# Altium schematic sheet 06 CPU_RAM.SchDoc
size 420 x 297 mm; Address1: Address1; Address2: Address2; Address3: Address3; Address4: Address4; DocumentNumber: АБВГ.123456.001 Э3; SheetNumber: 6; SheetTotal: 23; Scale: 1:1; DocumentType: Схема электрическая принципиальная; FirstReferrence: АБВГ.123456.001
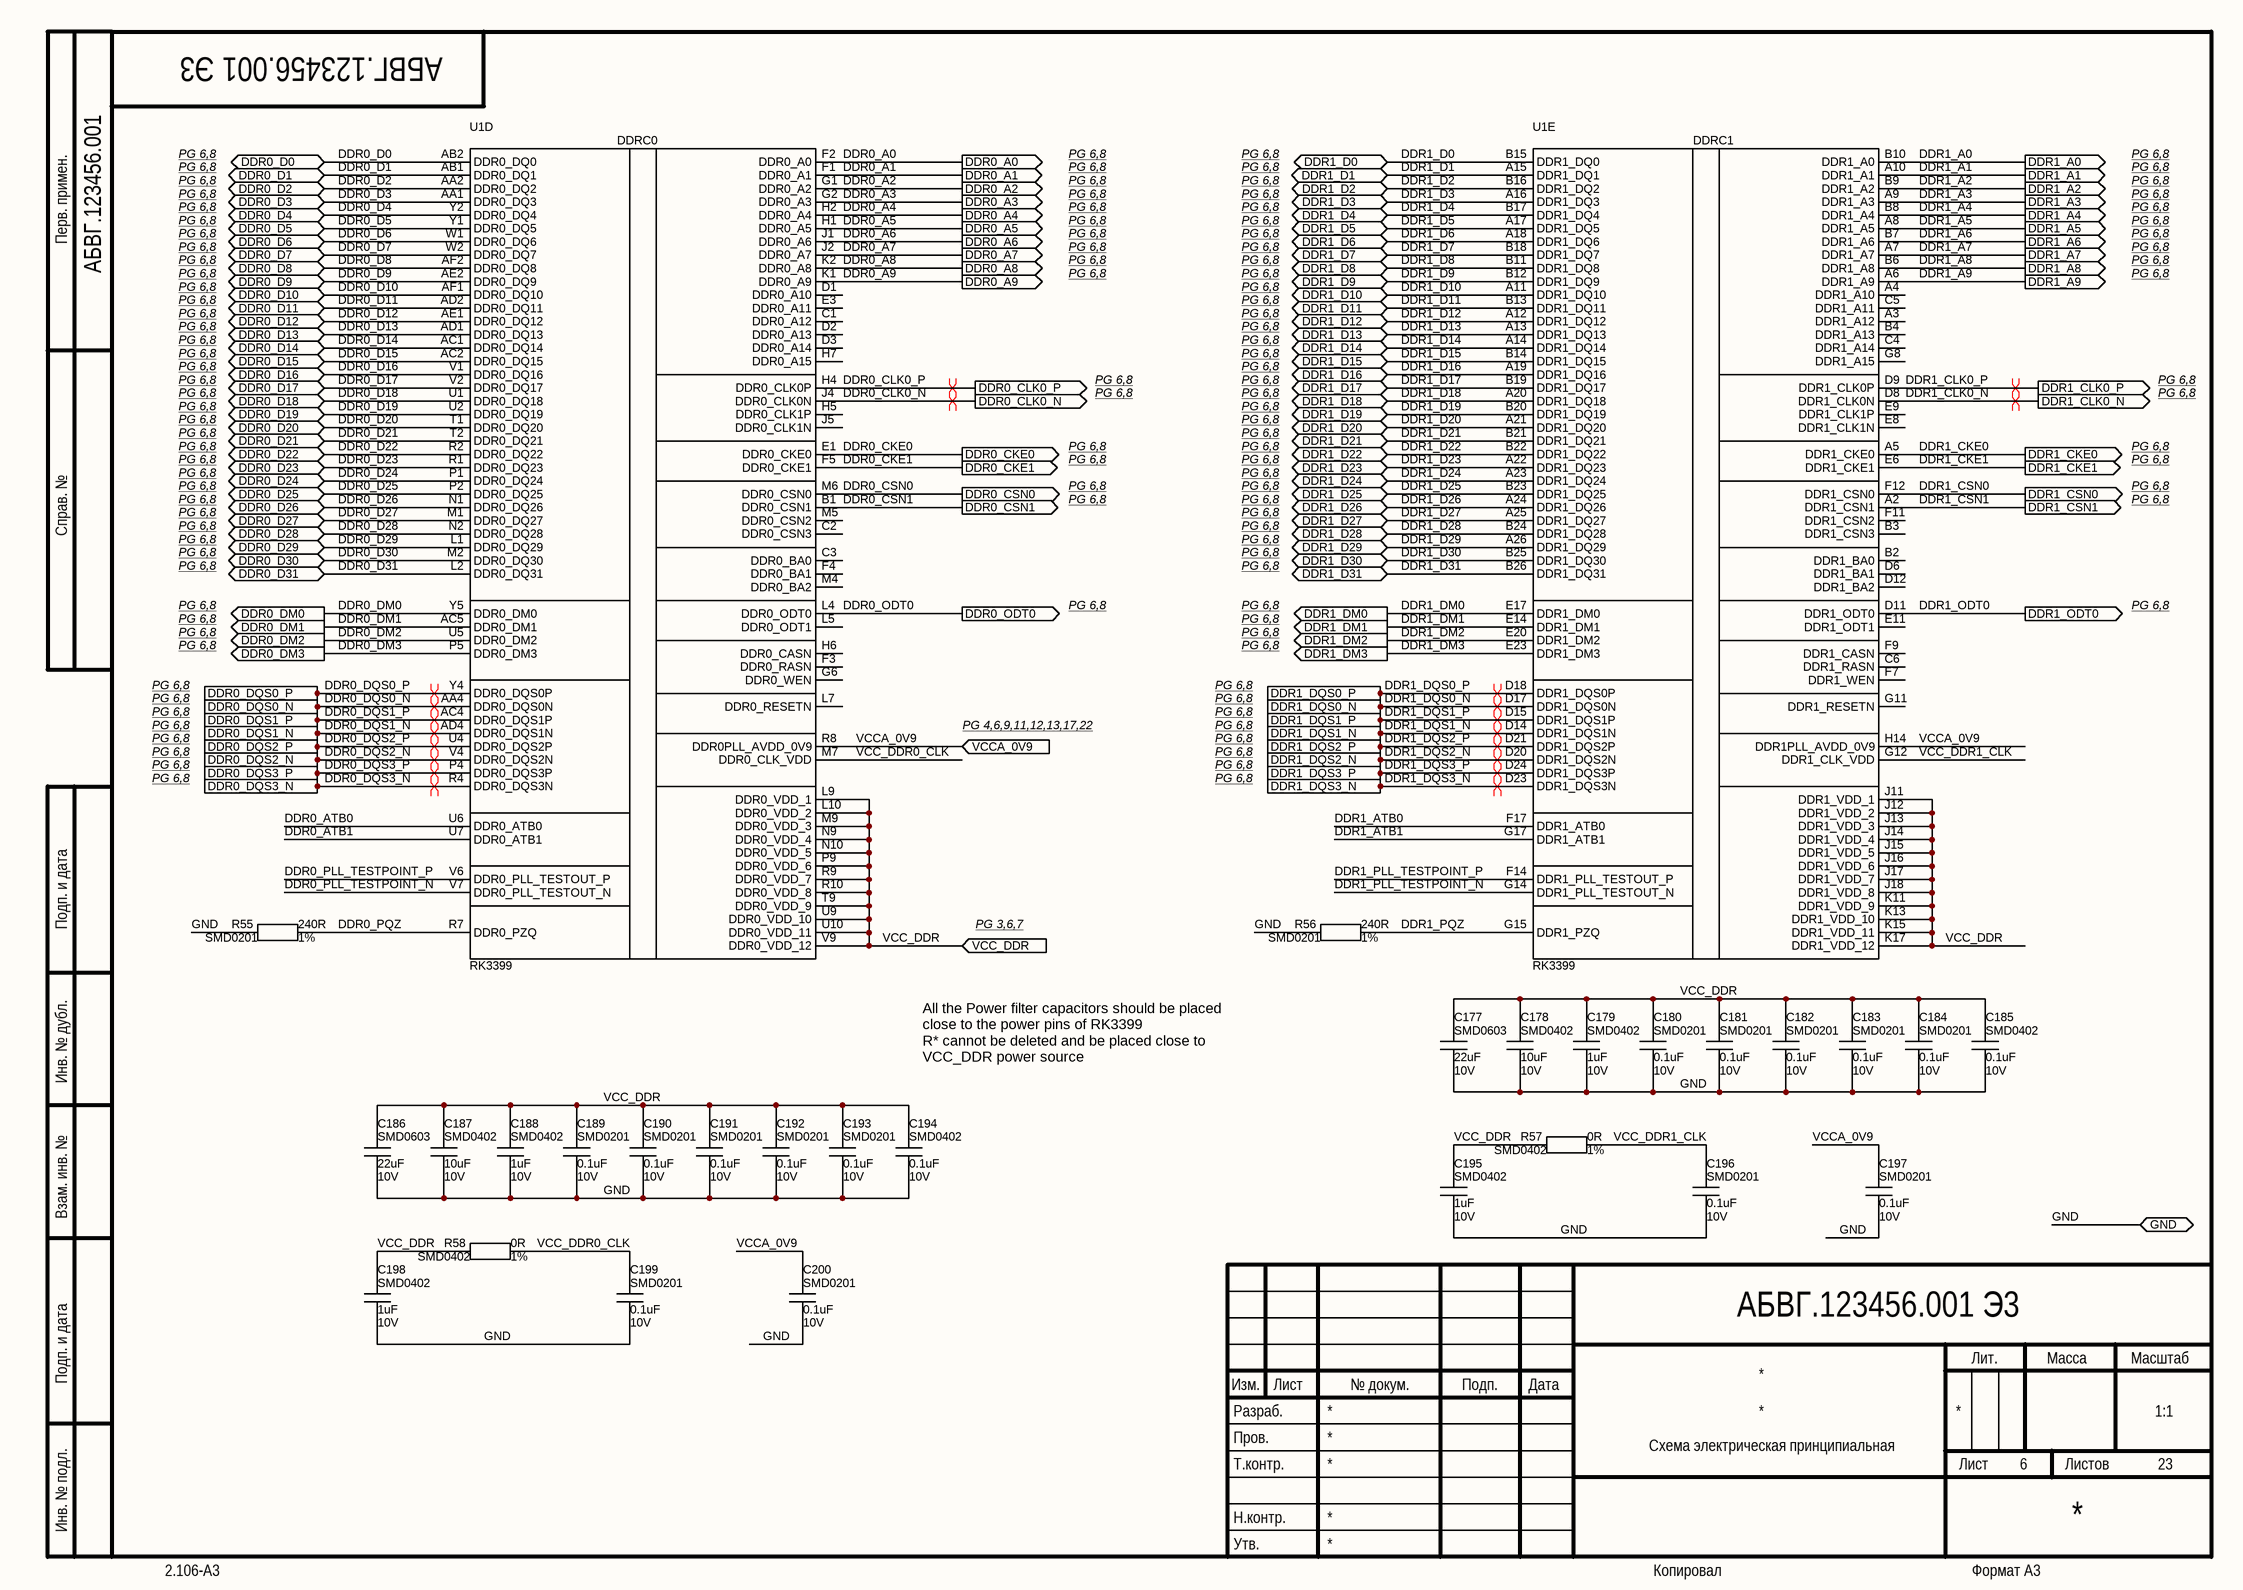
[diagram p0: 06 CPU_RAM.SchDoc]

## Parts
C177  Package: SMD0603  Voltage: 10V  [CAP_SMD_0603]  (hidden comment: 22uF)
C178  Package: SMD0402  Voltage: 10V  [CAP_SMD_0402_small]  (hidden comment: 10uF)
C179  Package: SMD0402  Voltage: 10V  [CAP_SMD_0402_small]  (hidden comment: 1uF)
C180  Package: SMD0201  Voltage: 10V  [CAP_SMD_0201]  (hidden comment: 0.1uF)
C181  Package: SMD0201  Voltage: 10V  [CAP_SMD_0201]  (hidden comment: 0.1uF)
C182  Package: SMD0201  Voltage: 10V  [CAP_SMD_0201]  (hidden comment: 0.1uF)
C183  Package: SMD0201  Voltage: 10V  [CAP_SMD_0201]  (hidden comment: 0.1uF)
C184  Package: SMD0201  Voltage: 10V  [CAP_SMD_0201]  (hidden comment: 0.1uF)
C185  Package: SMD0402  Voltage: 10V  [CAP_SMD_0402]  (hidden comment: 0.1uF)
C186  Package: SMD0603  Voltage: 10V  [CAP_SMD_0603]  (hidden comment: 22uF)
C187  Package: SMD0402  Voltage: 10V  [CAP_SMD_0402_small]  (hidden comment: 10uF)
C188  Package: SMD0402  Voltage: 10V  [CAP_SMD_0402_small]  (hidden comment: 1uF)
C189  Package: SMD0201  Voltage: 10V  [CAP_SMD_0201]  (hidden comment: 0.1uF)
C190  Package: SMD0201  Voltage: 10V  [CAP_SMD_0201]  (hidden comment: 0.1uF)
C191  Package: SMD0201  Voltage: 10V  [CAP_SMD_0201]  (hidden comment: 0.1uF)
C192  Package: SMD0201  Voltage: 10V  [CAP_SMD_0201]  (hidden comment: 0.1uF)
C193  Package: SMD0201  Voltage: 10V  [CAP_SMD_0201]  (hidden comment: 0.1uF)
C194  Package: SMD0402  Voltage: 10V  [CAP_SMD_0402]  (hidden comment: 0.1uF)
C195  Package: SMD0402  Voltage: 10V  [CAP_SMD_0402_small]  (hidden comment: 1uF)
C196  Package: SMD0201  Voltage: 10V  [CAP_SMD_0201]  (hidden comment: 0.1uF)
C197  Package: SMD0201  Voltage: 10V  [CAP_SMD_0201]  (hidden comment: 0.1uF)
C198  Package: SMD0402  Voltage: 10V  [CAP_SMD_0402_small]  (hidden comment: 1uF)
C199  Package: SMD0201  Voltage: 10V  [CAP_SMD_0201]  (hidden comment: 0.1uF)
C200  Package: SMD0201  Voltage: 10V  [CAP_SMD_0201]  (hidden comment: 0.1uF)
R55  Package: SMD0201  Tolerance: 1%  [RES_SMD_0201]  (hidden comment: 240R)
R56  Package: SMD0201  Tolerance: 1%  [RES_SMD_0201]  (hidden comment: 240R)
R57  Package: SMD0402  Tolerance: 1%  [RES_SMD_0402_SMALL]  (hidden comment: 0R)
R58  Package: SMD0402  Tolerance: 1%  [RES_SMD_0402_SMALL]  (hidden comment: 0R)
U1  value RK3399  [BGA828C65P31X31_2100X2100X161N]  (hidden comment: RK3399_FF)  (parts D,E of 23)

## Ports
DDR0_A0 (out), DDR0_A1 (out), DDR0_A2 (out), DDR0_A3 (out), DDR0_A4 (out), DDR0_A5 (out), DDR0_A6 (out), DDR0_A7 (out), DDR0_A8 (out), DDR0_A9 (out), DDR0_CKE0 (out), DDR0_CKE1 (out), DDR0_CLK0_N (out), DDR0_CLK0_P (out), DDR0_CSN0 (out), DDR0_CSN1 (out), DDR0_D0 (bidir), DDR0_D1 (bidir), DDR0_D2 (bidir), DDR0_D3 (bidir), DDR0_D4 (bidir), DDR0_D5 (bidir), DDR0_D6 (bidir), DDR0_D7 (bidir), DDR0_D8 (bidir), DDR0_D9 (bidir), DDR0_D10 (bidir), DDR0_D11 (bidir), DDR0_D12 (bidir), DDR0_D13 (bidir), DDR0_D14 (bidir), DDR0_D15 (bidir), DDR0_D16 (bidir), DDR0_D17 (bidir), DDR0_D18 (bidir), DDR0_D19 (bidir), DDR0_D20 (bidir), DDR0_D21 (bidir), DDR0_D22 (bidir), DDR0_D23 (bidir), DDR0_D24 (bidir), DDR0_D25 (bidir), DDR0_D26 (bidir), DDR0_D27 (bidir), DDR0_D28 (bidir), DDR0_D29 (bidir), DDR0_D30 (bidir), DDR0_D31 (bidir), DDR0_DM0 (out), DDR0_DM1 (out), DDR0_DM2 (out), DDR0_DM3 (out), DDR0_DQS0_N (out), DDR0_DQS0_P (out), DDR0_DQS1_N (out), DDR0_DQS1_P (out), DDR0_DQS2_N (out), DDR0_DQS2_P (out), DDR0_DQS3_N (out), DDR0_DQS3_P (out), DDR0_ODT0 (out), DDR1_A0 (out), DDR1_A1 (out), DDR1_A2 (out), DDR1_A3 (out), DDR1_A4 (out), DDR1_A5 (out), DDR1_A6 (out), DDR1_A7 (out), DDR1_A8 (out), DDR1_A9 (out), DDR1_CKE0 (out), DDR1_CKE1 (out), DDR1_CLK0_N (out), DDR1_CLK0_P (out), DDR1_CSN0 (out), DDR1_CSN1 (out), DDR1_D0 (bidir), DDR1_D1 (bidir), DDR1_D2 (bidir), DDR1_D3 (bidir), DDR1_D4 (bidir), DDR1_D5 (bidir), DDR1_D6 (bidir), DDR1_D7 (bidir), DDR1_D8 (bidir), DDR1_D9 (bidir), DDR1_D10 (bidir), DDR1_D11 (bidir), DDR1_D12 (bidir), DDR1_D13 (bidir), DDR1_D14 (bidir), DDR1_D15 (bidir), DDR1_D16 (bidir), DDR1_D17 (bidir), DDR1_D18 (bidir), DDR1_D19 (bidir), DDR1_D20 (bidir), DDR1_D21 (bidir), DDR1_D22 (bidir), DDR1_D23 (bidir), DDR1_D24 (bidir), DDR1_D25 (bidir), DDR1_D26 (bidir), DDR1_D27 (bidir), DDR1_D28 (bidir), DDR1_D29 (bidir), DDR1_D30 (bidir), DDR1_D31 (bidir), DDR1_DM0 (out), DDR1_DM1 (out), DDR1_DM2 (out), DDR1_DM3 (out), DDR1_DQS0_N (out), DDR1_DQS0_P (out), DDR1_DQS1_N (out), DDR1_DQS1_P (out), DDR1_DQS2_N (out), DDR1_DQS2_P (out), DDR1_DQS3_N (out), DDR1_DQS3_P (out), DDR1_ODT0 (out), GND (bidir), VCC_DDR (in), VCCA_0V9 (in)

## Nets
DDR0_A0: U1.F2(DDR0_A0) ; port DDR0_A0
DDR0_A1: U1.F1(DDR0_A1) ; port DDR0_A1
DDR0_A2: U1.G1(DDR0_A2) ; port DDR0_A2
DDR0_A3: U1.G2(DDR0_A3) ; port DDR0_A3
DDR0_A4: U1.H2(DDR0_A4) ; port DDR0_A4
DDR0_A5: U1.H1(DDR0_A5) ; port DDR0_A5
DDR0_A6: U1.J1(DDR0_A6) ; port DDR0_A6
DDR0_A7: U1.J2(DDR0_A7) ; port DDR0_A7
DDR0_A8: U1.K2(DDR0_A8) ; port DDR0_A8
DDR0_A9: U1.K1(DDR0_A9) ; port DDR0_A9
DDR0_ATB0: U1.U6(DDR0_ATB0)
DDR0_ATB1: U1.U7(DDR0_ATB1)
DDR0_CKE0: U1.E1(DDR0_CKE0) ; port DDR0_CKE0
DDR0_CKE1: U1.F5(DDR0_CKE1) ; port DDR0_CKE1
DDR0_CLK0_N: U1.J4(DDR0_CLK0N) ; port DDR0_CLK0_N
DDR0_CLK0_P: U1.H4(DDR0_CLK0P) ; port DDR0_CLK0_P
DDR0_CSN0: U1.M6(DDR0_CSN0) ; port DDR0_CSN0
DDR0_CSN1: U1.B1(DDR0_CSN1) ; port DDR0_CSN1
DDR0_D0: U1.AB2(DDR0_DQ0) ; port DDR0_D0
DDR0_D1: U1.AB1(DDR0_DQ1) ; port DDR0_D1
DDR0_D2: U1.AA2(DDR0_DQ2) ; port DDR0_D2
DDR0_D3: U1.AA1(DDR0_DQ3) ; port DDR0_D3
DDR0_D4: U1.Y2(DDR0_DQ4) ; port DDR0_D4
DDR0_D5: U1.Y1(DDR0_DQ5) ; port DDR0_D5
DDR0_D6: U1.W1(DDR0_DQ6) ; port DDR0_D6
DDR0_D7: U1.W2(DDR0_DQ7) ; port DDR0_D7
DDR0_D8: U1.AF2(DDR0_DQ8) ; port DDR0_D8
DDR0_D9: U1.AE2(DDR0_DQ9) ; port DDR0_D9
DDR0_D10: U1.AF1(DDR0_DQ10) ; port DDR0_D10
DDR0_D11: U1.AD2(DDR0_DQ11) ; port DDR0_D11
DDR0_D12: U1.AE1(DDR0_DQ12) ; port DDR0_D12
DDR0_D13: U1.AD1(DDR0_DQ13) ; port DDR0_D13
DDR0_D14: U1.AC1(DDR0_DQ14) ; port DDR0_D14
DDR0_D15: U1.AC2(DDR0_DQ15) ; port DDR0_D15
DDR0_D16: U1.V1(DDR0_DQ16) ; port DDR0_D16
DDR0_D17: U1.V2(DDR0_DQ17) ; port DDR0_D17
DDR0_D18: U1.U1(DDR0_DQ18) ; port DDR0_D18
DDR0_D19: U1.U2(DDR0_DQ19) ; port DDR0_D19
DDR0_D20: U1.T1(DDR0_DQ20) ; port DDR0_D20
DDR0_D21: U1.T2(DDR0_DQ21) ; port DDR0_D21
DDR0_D22: U1.R2(DDR0_DQ22) ; port DDR0_D22
DDR0_D23: U1.R1(DDR0_DQ23) ; port DDR0_D23
DDR0_D24: U1.P1(DDR0_DQ24) ; port DDR0_D24
DDR0_D25: U1.P2(DDR0_DQ25) ; port DDR0_D25
DDR0_D26: U1.N1(DDR0_DQ26) ; port DDR0_D26
DDR0_D27: U1.M1(DDR0_DQ27) ; port DDR0_D27
DDR0_D28: U1.N2(DDR0_DQ28) ; port DDR0_D28
DDR0_D29: U1.L1(DDR0_DQ29) ; port DDR0_D29
DDR0_D30: U1.M2(DDR0_DQ30) ; port DDR0_D30
DDR0_D31: U1.L2(DDR0_DQ31) ; port DDR0_D31
DDR0_DM0: U1.Y5(DDR0_DM0) ; port DDR0_DM0
DDR0_DM1: U1.AC5(DDR0_DM1) ; port DDR0_DM1
DDR0_DM2: U1.U5(DDR0_DM2) ; port DDR0_DM2
DDR0_DM3: U1.P5(DDR0_DM3) ; port DDR0_DM3
DDR0_DQS0_N: U1.AA4(DDR0_DQS0N) ; port DDR0_DQS0_N
DDR0_DQS0_P: U1.Y4(DDR0_DQS0P) ; port DDR0_DQS0_P
DDR0_DQS1_N: U1.AD4(DDR0_DQS1N) ; port DDR0_DQS1_N
DDR0_DQS1_P: U1.AC4(DDR0_DQS1P) ; port DDR0_DQS1_P
DDR0_DQS2_N: U1.V4(DDR0_DQS2N) ; port DDR0_DQS2_N
DDR0_DQS2_P: U1.U4(DDR0_DQS2P) ; port DDR0_DQS2_P
DDR0_DQS3_N: U1.R4(DDR0_DQS3N) ; port DDR0_DQS3_N
DDR0_DQS3_P: U1.P4(DDR0_DQS3P) ; port DDR0_DQS3_P
DDR0_ODT0: U1.L4(DDR0_ODT0) ; port DDR0_ODT0
DDR0_PLL_TESTPOINT_N: U1.V7(DDR0_PLL_TESTOUT_N)
DDR0_PLL_TESTPOINT_P: U1.V6(DDR0_PLL_TESTOUT_P)
DDR0_PQZ: R55.1 U1.R7(DDR0_PZQ)
DDR1_A0: U1.B10(DDR1_A0) ; port DDR1_A0
DDR1_A1: U1.A10(DDR1_A1) ; port DDR1_A1
DDR1_A2: U1.B9(DDR1_A2) ; port DDR1_A2
DDR1_A3: U1.A9(DDR1_A3) ; port DDR1_A3
DDR1_A4: U1.B8(DDR1_A4) ; port DDR1_A4
DDR1_A5: U1.A8(DDR1_A5) ; port DDR1_A5
DDR1_A6: U1.B7(DDR1_A6) ; port DDR1_A6
DDR1_A7: U1.A7(DDR1_A7) ; port DDR1_A7
DDR1_A8: U1.B6(DDR1_A8) ; port DDR1_A8
DDR1_A9: U1.A6(DDR1_A9) ; port DDR1_A9
DDR1_ATB0: U1.F17(DDR1_ATB0)
DDR1_ATB1: U1.G17(DDR1_ATB1)
DDR1_CKE0: U1.A5(DDR1_CKE0) ; port DDR1_CKE0
DDR1_CKE1: U1.E6(DDR1_CKE1) ; port DDR1_CKE1
DDR1_CLK0_N: U1.D8(DDR1_CLK0N) ; port DDR1_CLK0_N
DDR1_CLK0_P: U1.D9(DDR1_CLK0P) ; port DDR1_CLK0_P
DDR1_CSN0: U1.F12(DDR1_CSN0) ; port DDR1_CSN0
DDR1_CSN1: U1.A2(DDR1_CSN1) ; port DDR1_CSN1
DDR1_D0: U1.B15(DDR1_DQ0) ; port DDR1_D0
DDR1_D1: U1.A15(DDR1_DQ1) ; port DDR1_D1
DDR1_D2: U1.B16(DDR1_DQ2) ; port DDR1_D2
DDR1_D3: U1.A16(DDR1_DQ3) ; port DDR1_D3
DDR1_D4: U1.B17(DDR1_DQ4) ; port DDR1_D4
DDR1_D5: U1.A17(DDR1_DQ5) ; port DDR1_D5
DDR1_D6: U1.A18(DDR1_DQ6) ; port DDR1_D6
DDR1_D7: U1.B18(DDR1_DQ7) ; port DDR1_D7
DDR1_D8: U1.B11(DDR1_DQ8) ; port DDR1_D8
DDR1_D9: U1.B12(DDR1_DQ9) ; port DDR1_D9
DDR1_D10: U1.A11(DDR1_DQ10) ; port DDR1_D10
DDR1_D11: U1.B13(DDR1_DQ11) ; port DDR1_D11
DDR1_D12: U1.A12(DDR1_DQ12) ; port DDR1_D12
DDR1_D13: U1.A13(DDR1_DQ13) ; port DDR1_D13
DDR1_D14: U1.A14(DDR1_DQ14) ; port DDR1_D14
DDR1_D15: U1.B14(DDR1_DQ15) ; port DDR1_D15
DDR1_D16: U1.A19(DDR1_DQ16) ; port DDR1_D16
DDR1_D17: U1.B19(DDR1_DQ17) ; port DDR1_D17
DDR1_D18: U1.A20(DDR1_DQ18) ; port DDR1_D18
DDR1_D19: U1.B20(DDR1_DQ19) ; port DDR1_D19
DDR1_D20: U1.A21(DDR1_DQ20) ; port DDR1_D20
DDR1_D21: U1.B21(DDR1_DQ21) ; port DDR1_D21
DDR1_D22: U1.B22(DDR1_DQ22) ; port DDR1_D22
DDR1_D23: U1.A22(DDR1_DQ23) ; port DDR1_D23
DDR1_D24: U1.A23(DDR1_DQ24) ; port DDR1_D24
DDR1_D25: U1.B23(DDR1_DQ25) ; port DDR1_D25
DDR1_D26: U1.A24(DDR1_DQ26) ; port DDR1_D26
DDR1_D27: U1.A25(DDR1_DQ27) ; port DDR1_D27
DDR1_D28: U1.B24(DDR1_DQ28) ; port DDR1_D28
DDR1_D29: U1.A26(DDR1_DQ29) ; port DDR1_D29
DDR1_D30: U1.B25(DDR1_DQ30) ; port DDR1_D30
DDR1_D31: U1.B26(DDR1_DQ31) ; port DDR1_D31
DDR1_DM0: U1.E17(DDR1_DM0) ; port DDR1_DM0
DDR1_DM1: U1.E14(DDR1_DM1) ; port DDR1_DM1
DDR1_DM2: U1.E20(DDR1_DM2) ; port DDR1_DM2
DDR1_DM3: U1.E23(DDR1_DM3) ; port DDR1_DM3
DDR1_DQS0_N: U1.D17(DDR1_DQS0N) ; port DDR1_DQS0_N
DDR1_DQS0_P: U1.D18(DDR1_DQS0P) ; port DDR1_DQS0_P
DDR1_DQS1_N: U1.D14(DDR1_DQS1N) ; port DDR1_DQS1_N
DDR1_DQS1_P: U1.D15(DDR1_DQS1P) ; port DDR1_DQS1_P
DDR1_DQS2_N: U1.D20(DDR1_DQS2N) ; port DDR1_DQS2_N
DDR1_DQS2_P: U1.D21(DDR1_DQS2P) ; port DDR1_DQS2_P
DDR1_DQS3_N: U1.D23(DDR1_DQS3N) ; port DDR1_DQS3_N
DDR1_DQS3_P: U1.D24(DDR1_DQS3P) ; port DDR1_DQS3_P
DDR1_ODT0: U1.D11(DDR1_ODT0) ; port DDR1_ODT0
DDR1_PLL_TESTPOINT_N: U1.G14(DDR1_PLL_TESTOUT_N)
DDR1_PLL_TESTPOINT_P: U1.F14(DDR1_PLL_TESTOUT_P)
DDR1_PQZ: R56.1 U1.G15(DDR1_PZQ)
GND: C177.1 C178.2 C179.2 C180.2 C181.2 C182.2 C183.2 C184.2 C185.2 C186.1 C187.2 C188.2 C189.2 C190.2 C191.2 C192.2 C193.2 C194.2 C195.2 C196.2 C197.2 C198.2 C199.2 C200.2 R55.2 R56.2 ; port GND
VCC_DDR: C177.2 C178.1 C179.1 C180.1 C181.1 C182.1 C183.1 C184.1 C185.1 C186.2 C187.1 C188.1 C189.1 C190.1 C191.1 C192.1 C193.1 C194.1 C195.1 C198.1 R57.1 R58.1 U1.J11(DDR1_VDD_1) U1.J12(DDR1_VDD_2) U1.J13(DDR1_VDD_3) U1.J14(DDR1_VDD_4) U1.J15(DDR1_VDD_5) U1.J16(DDR1_VDD_6) U1.J17(DDR1_VDD_7) U1.J18(DDR1_VDD_8) U1.K11(DDR1_VDD_9) U1.K13(DDR1_VDD_10) U1.K15(DDR1_VDD_11) U1.K17(DDR1_VDD_12) U1.L9(DDR0_VDD_1) U1.L10(DDR0_VDD_2) U1.M9(DDR0_VDD_3) U1.N9(DDR0_VDD_4) U1.N10(DDR0_VDD_5) U1.P9(DDR0_VDD_6) U1.R9(DDR0_VDD_7) U1.R10(DDR0_VDD_8) U1.T9(DDR0_VDD_9) U1.U9(DDR0_VDD_10) U1.U10(DDR0_VDD_11) U1.V9(DDR0_VDD_12) ; port VCC_DDR
VCC_DDR0_CLK: C199.1 R58.2 U1.M7(DDR0_CLK_VDD)
VCC_DDR1_CLK: C196.1 R57.2 U1.G12(DDR1_CLK_VDD)
VCCA_0V9: C197.1 C200.1 U1.H14(DDR1PLL_AVDD_0V9) U1.R8(DDR0PLL_AVDD_0V9) ; port VCCA_0V9

Not connected (* = marked no-connect by the designer): U1 A3(DDR1_A12) A4(DDR1_A10) B2(DDR1_BA0) B3(DDR1_CSN3) B4(DDR1_A13) C1(DDR0_A12) C2(DDR0_CSN3) C3(DDR0_BA0) C4(DDR1_A14) C5(DDR1_A11) C6(DDR1_RASN) D1(DDR0_A10) D2(DDR0_A13) D3(DDR0_A14) D6(DDR1_BA1) D12(DDR1_BA2) E3(DDR0_A11) E8(DDR1_CLK1N) E9(DDR1_CLK1P) E11(DDR1_ODT1) F3(DDR0_RASN) F4(DDR0_BA1) F7(DDR1_WEN) F9(DDR1_CASN) F11(DDR1_CSN2) G6(DDR0_WEN) G8(DDR1_A15) G11(DDR1_RESETN) H5(DDR0_CLK1P) H6(DDR0_CASN) H7(DDR0_A15) J5(DDR0_CLK1N) L5(DDR0_ODT1) L7(DDR0_RESETN) M4(DDR0_BA2) M5(DDR0_CSN2)

## Layout directives
differential pair; differential pair class DiffPair_1; net class DiffPair_1: DDR0_CLK0_N, DDR0_CLK0_P, DDR0_DQS0_N, DDR0_DQS0_P, DDR0_DQS1_N, DDR0_DQS1_P, DDR0_DQS2_N, DDR0_DQS2_P, DDR0_DQS3_N, DDR0_DQS3_P
differential pair; net class DiffPair_1; differential pair class DiffPair_1: DDR1_CLK0_N, DDR1_CLK0_P, DDR1_DQS0_N, DDR1_DQS0_P, DDR1_DQS1_N, DDR1_DQS1_P, DDR1_DQS2_N, DDR1_DQS2_P, DDR1_DQS3_N, DDR1_DQS3_P

## Notes on the sheet
- PG 6,8
- Перв. примен.
- Справ. №
- PG 4,6,9,11,12,13,17,22
- Подп. и дата
- PG 3,6,7
- All the Power filter capacitors should be placed
  close to the power pins of RK3399
  R* cannot be deleted and be placed close to
  VCC_DDR power source
- Инв. № дубл.
- Взам. инв. №
- Разраб.
- Изм.
- Лист
- № докум.
- Подп.
- Дата
- Лит.
- Масса
- Масштаб
- Пров.
- Т.контр.
- Листов
- Инв. № подл.
- Утв.
- Н.контр.
- 2.106-A3
- Копировал
- Формат А3
- (in symbol RK3399_FF, part D) DDRC0
- (in symbol RK3399_FF, part E) DDRC1

## Library data of the parts
C177 C186 = Ceramic_Cap: PartNumber: CL10A226MP8NUNE; ComponentType: SMD Ceramic Chip Capacitor; Manufacter: *; Tolerance: *; ClassName: *; Value: 22uF
C178 C187 = Ceramic_Cap: PartNumber: CC0402MRX5R6BB106; ComponentType: SMD Ceramic Chip Capacitor; Manufacter: *; Tolerance: *; ClassName: Solder_Clearence; Value: 10uF
C179 C188 C195 C198 = Ceramic_Cap: PartNumber: CC0402KRX5R6BB105; ComponentType: SMD Ceramic Chip Capacitor; Manufacter: *; Tolerance: *; ClassName: Solder_Clearence; Value: 1uF
C180-C184 C189-C193 C196 C197 C199 C200 = Ceramic_Cap: PartNumber: CC0201KRX5R6BB104; ComponentType: SMD Ceramic Chip Capacitor; Manufacter: *; Tolerance: *; ClassName: *; Value: 0.1uF
C185 C194 = Ceramic_Cap: PartNumber: CC0402KRX5R6BB104; ComponentType: SMD Ceramic Chip Capacitor; Manufacter: *; Tolerance: *; ClassName: *; Value: 0.1uF
R55 R56 = Chip_Res: PartNumber: RC0201FR-07240RL; ComponentType: SMD Chip Resistor; Manufacter: *; Voltage: *; ClassName: *; Value: 240R
R57 R58 = Chip_Res: PartNumber: RC0402FR-070RL; ComponentType: SMD Chip Resistor; Manufacter: *; Voltage: *; ClassName: Solder_Clearence; Value: 0R
U1 = RK3399_FF: Package: BGA828; ComponentType: *; Manufacter: *; PartNumber: RK3399; ClassName: *